# EAGLE design M908X (EAGLE 6.6.0)
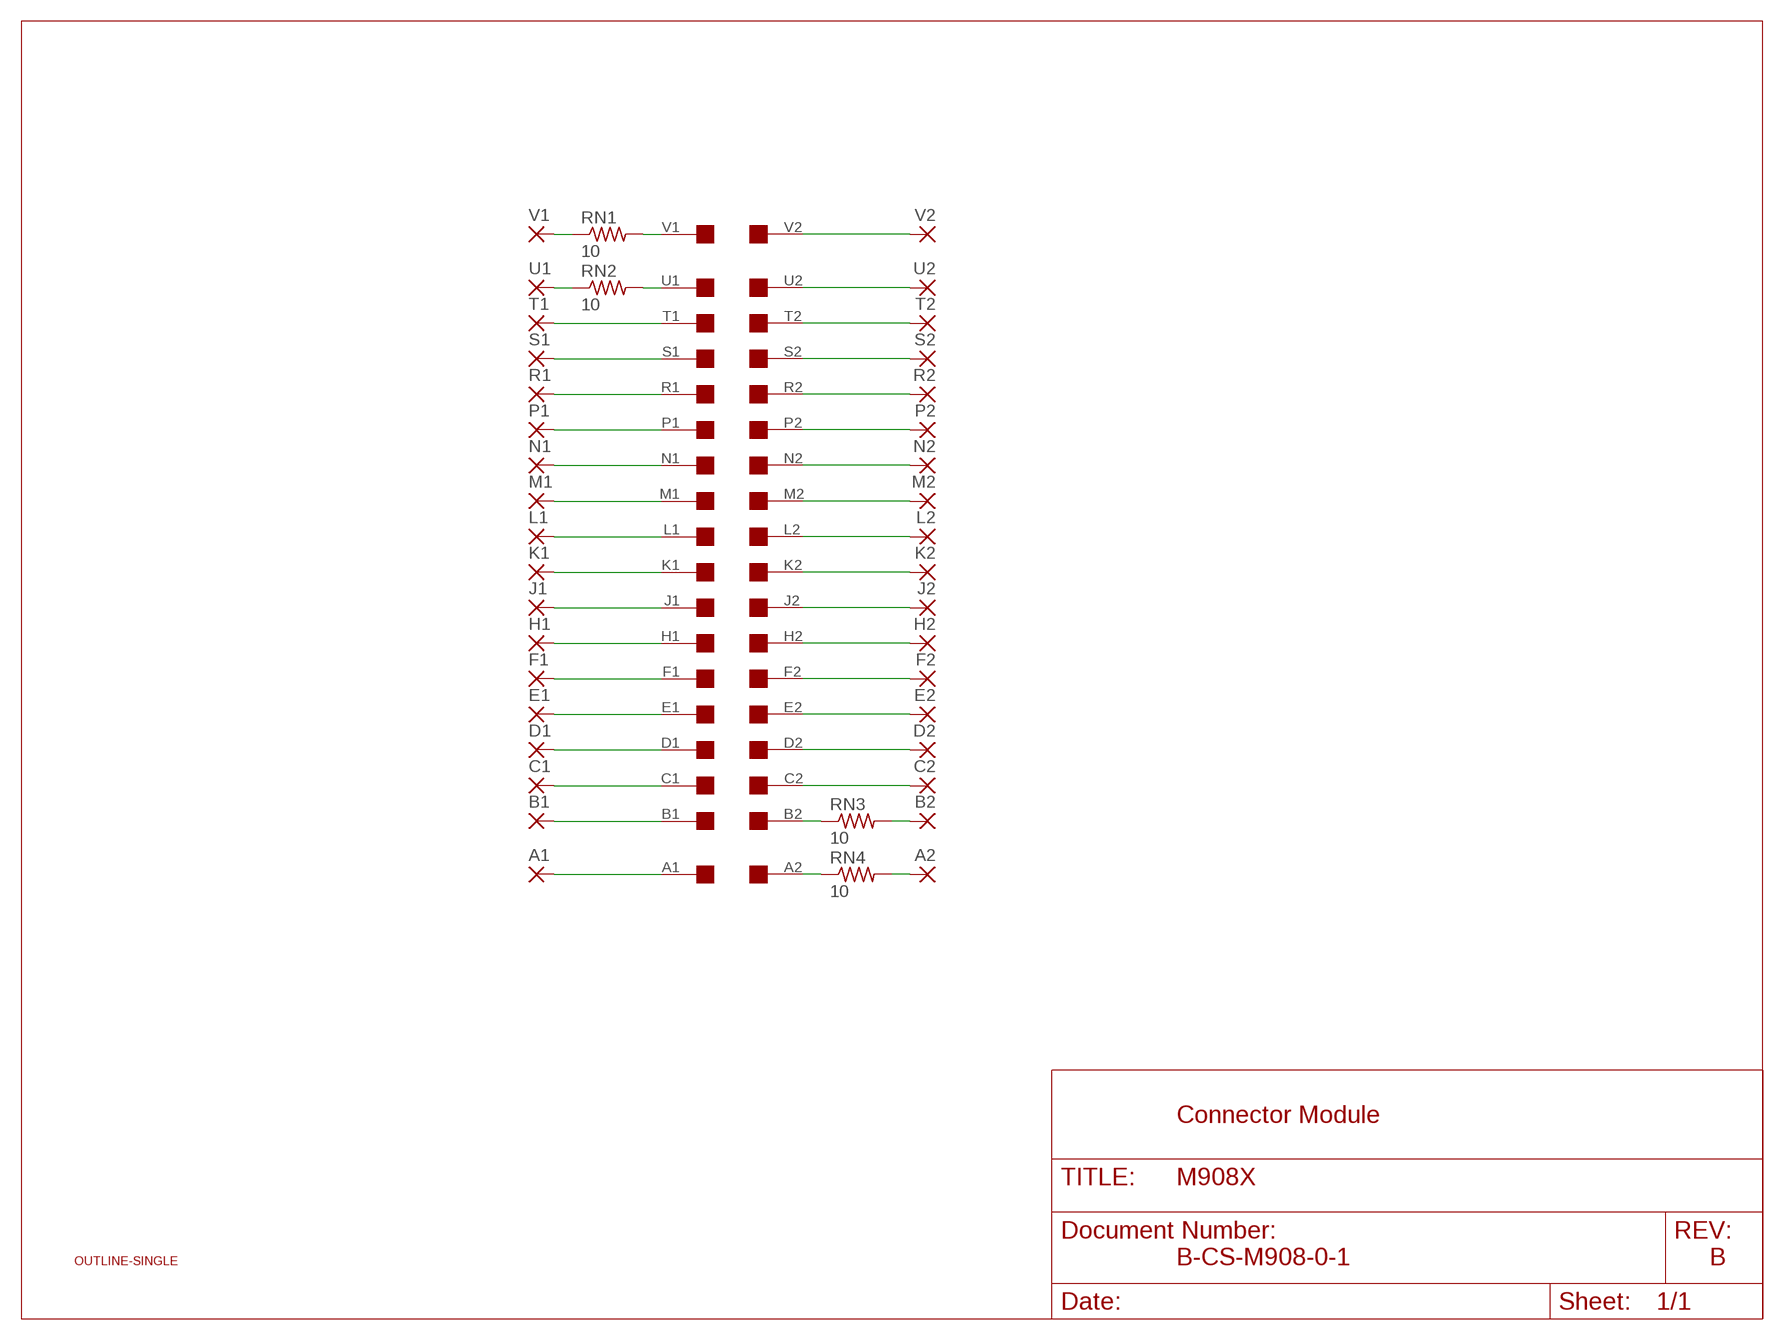
[diagram p0: schematic, sheet 1]

## Parts
A1  2,54/1,0  [2,54/1,0]
A2  2,54/1,0  [2,54/1,0]
B1  2,54/1,0  [2,54/1,0]
B2  2,54/1,0  [2,54/1,0]
C1  2,54/1,0  [2,54/1,0]
C2  2,54/1,0  [2,54/1,0]
D1  2,54/1,0  [2,54/1,0]
D2  2,54/1,0  [2,54/1,0]
E1  2,54/1,0  [2,54/1,0]
E2  2,54/1,0  [2,54/1,0]
F1  2,54/1,0  [2,54/1,0]
F2  2,54/1,0  [2,54/1,0]
H1  2,54/1,0  [2,54/1,0]
H2  2,54/1,0  [2,54/1,0]
J1  2,54/1,0  [2,54/1,0]
J2  2,54/1,0  [2,54/1,0]
K1  2,54/1,0  [2,54/1,0]
K2  2,54/1,0  [2,54/1,0]
L1  2,54/1,0  [2,54/1,0]
L2  2,54/1,0  [2,54/1,0]
M1  2,54/1,0  [2,54/1,0]
M2  2,54/1,0  [2,54/1,0]
N1  2,54/1,0  [2,54/1,0]
N2  2,54/1,0  [2,54/1,0]
P1  2,54/1,0  [2,54/1,0]
P2  2,54/1,0  [2,54/1,0]
R1  2,54/1,0  [2,54/1,0]
R2  2,54/1,0  [2,54/1,0]
RN1  10  R-US_0207/10  [0207/10]
RN2  10  R-US_0207/10  [0207/10]
RN3  10  R-US_0207/10  [0207/10]
RN4  10  R-US_0207/10  [0207/10]
S1  2,54/1,0  [2,54/1,0]
S2  2,54/1,0  [2,54/1,0]
T1  2,54/1,0  [2,54/1,0]
T2  2,54/1,0  [2,54/1,0]
U1  2,54/1,0  [2,54/1,0]
U2  2,54/1,0  [2,54/1,0]
U$1  SINGLE  [EDGE-CON2]
U$2  OUTLINE-SINGLE  [SINGLE]
V1  2,54/1,0  [2,54/1,0]
V2  2,54/1,0  [2,54/1,0]

## Nets
N$4: D1.1(P) U$1.D1
N$5: E1.1(P) U$1.E1
N$6: F1.1(P) U$1.F1
N$7: H1.1(P) U$1.H1
N$8: J1.1(P) U$1.J1
N$9: K1.1(P) U$1.K1
N$10: L1.1(P) U$1.L1
N$11: M1.1(P) U$1.M1
N$12: N1.1(P) U$1.N1
N$13: P1.1(P) U$1.P1
N$14: R1.1(P) U$1.R1
N$15: S1.1(P) U$1.S1
N$16: T1.1(P) U$1.T1
N$17: RN2.2 U$1.U1
N$18: RN1.2 U$1.V1
N$19: A2.1(P) RN4.2
N$20: B2.1(P) RN3.2
N$21: C2.1(P) U$1.C2
N$22: D2.1(P) U$1.D2
N$23: E2.1(P) U$1.E2
N$24: F2.1(P) U$1.F2
N$25: H2.1(P) U$1.H2
N$26: J2.1(P) U$1.J2
N$27: K2.1(P) U$1.K2
N$28: L2.1(P) U$1.L2
N$29: M2.1(P) U$1.M2
N$30: N2.1(P) U$1.N2
N$31: P2.1(P) U$1.P2
N$32: R2.1(P) U$1.R2
N$33: S2.1(P) U$1.S2
N$34: T2.1(P) U$1.T2
N$35: U2.1(P) U$1.U2
N$36: U$1.V2 V2.1(P)
N$37: RN1.1 V1.1(P)
N$38: RN2.1 U1.1(P)
N$39: RN3.1 U$1.B2
N$40: RN4.1 U$1.A2
N$41: A1.1(P) U$1.A1
N$42: B1.1(P) U$1.B1
N$43: C1.1(P) U$1.C1

## Notes on the sheet
- Connector Module
- B-CS-M908-0-1 | B

## Library data of the parts
A1 A2 B1 B2 C1 C2 D1 D2 E1 E2 F1 F2 H1 H2 J1 J2 K1 K2 L1 L2 M1 M2 N1 N2 P1 P2 R1 R2 S1 S2 T1 T2 U1 U2 V1 V2 = wirepad:2,54/1,0: THROUGH-HOLE PAD
RN1-RN4 = rcl:R-US_: RESISTOR, American symbol
U$1 = dec-con:SINGLE: Single-Height DEC board
U$2 = dec-con:OUTLINE-*: Board outlines for DEC boards.

## Board
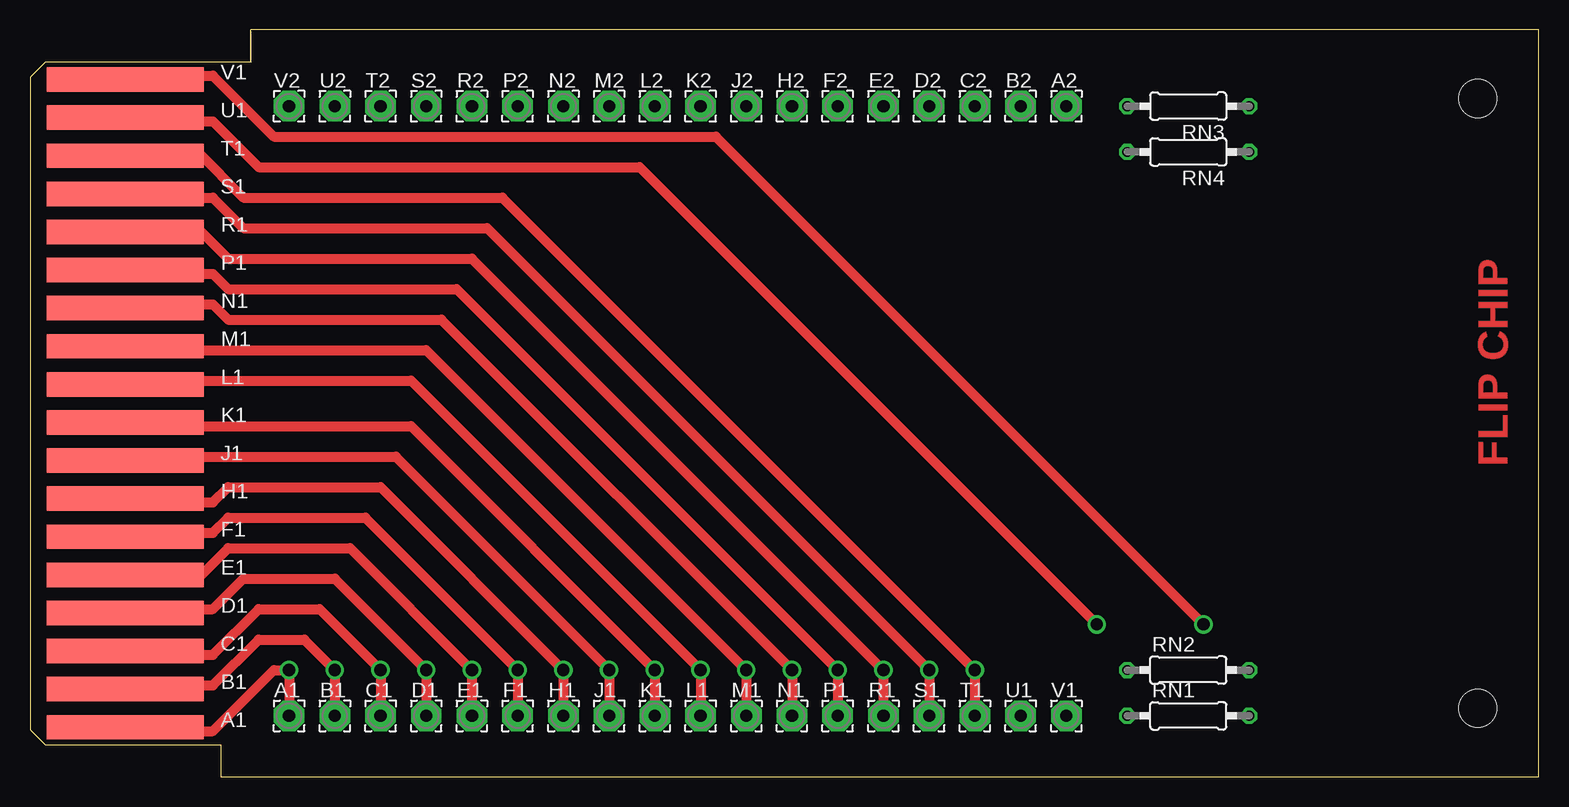
[diagram p1: board, top side]
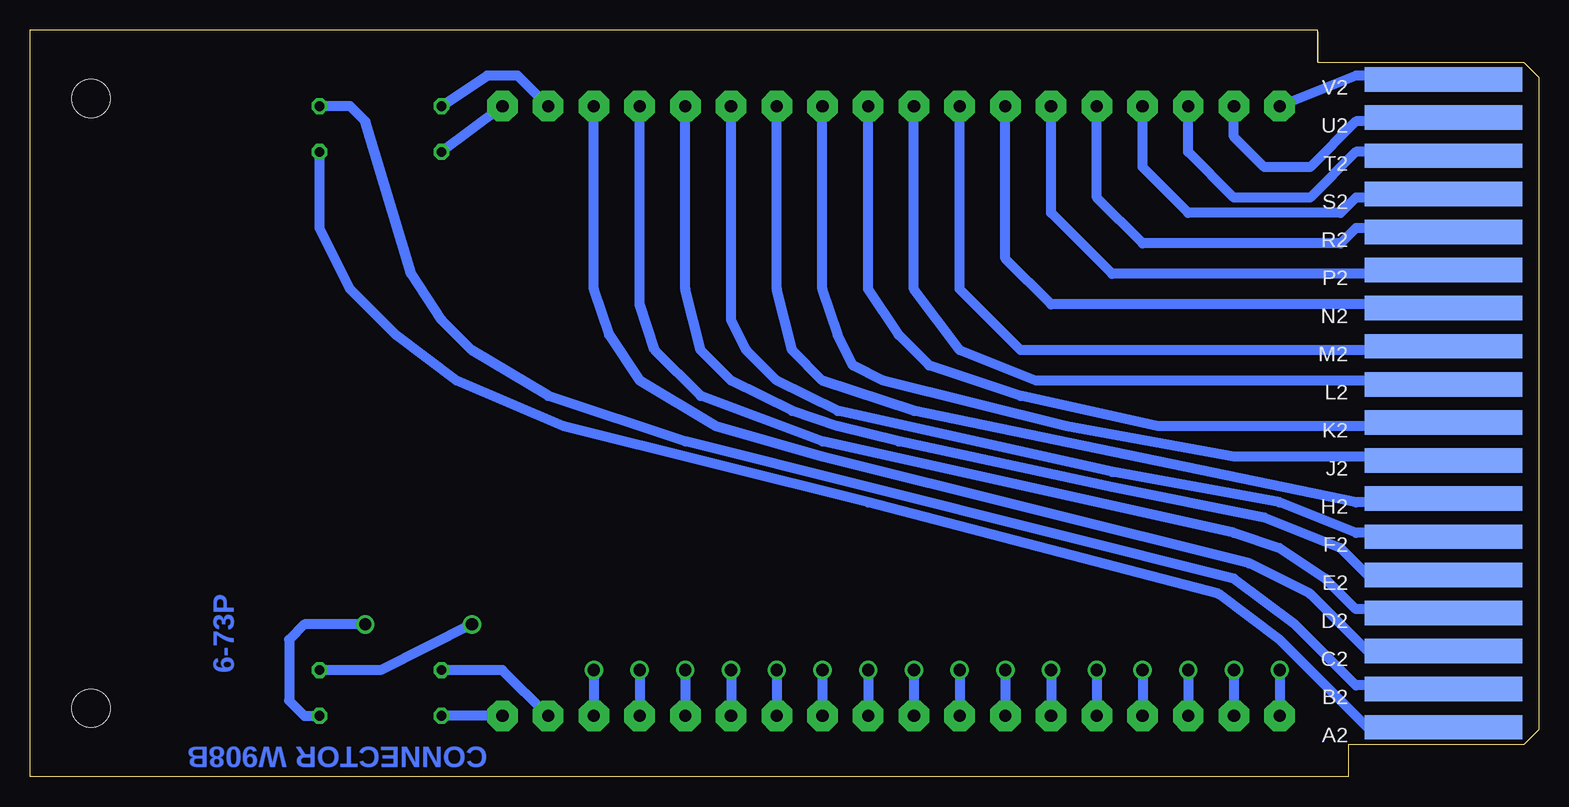
[diagram p2: board, bottom side, seen from below]

Size 125.73 x 62.23 mm. Coordinates in mm from the lower left corner, seen from the top.
Copper layers (1+16): Top 0.035mm / dielectric 1.5mm / Bottom 0.035mm
Design rules "16mils": minimum track width 16mil, minimum drill 32mil, track to track 15mil, track to pad 10mil, pad to pad 10mil, via to via 10mil, smd to smd 10mil, copper to edge 13mil, drill to drill 10mil, minimum pad ring 10mil, minimum via ring 8mil, stop-mask expansion 0mil, vias tented up to drill 0mil, thermal gap 10mil

### Footprints (pad centres in the part's own frame; a part is rotated, then mirrored left to right if it is on the bottom)
2,54/1,0 = drill 1.016 pad 2.54 octagon: 1 0,0
0207/10 = drill 0.813 octagon: 1 -5.08,0; 2 5.08,0
EDGE-CON2 = smd 13.106 x 2.032: A1 7.938,4.128; B1 7.938,7.303; C1 7.938,10.477; D1 7.938,13.652; E1 7.938,16.828; F1 7.938,20.003; H1 7.938,23.177; J1 7.938,26.352; K1 7.938,29.527; L1 7.938,32.703; M1 7.938,35.877; N1 7.938,39.053; P1 7.938,42.227; R1 7.938,45.403; S1 7.938,48.578; T1 7.938,51.752; U1 7.938,54.928; V1 7.938,58.102 | smd 13.106 x 2.032 bottom: A2 7.938,4.128; B2 7.938,7.303; C2 7.938,10.477; D2 7.938,13.652; E2 7.938,16.828; F2 7.938,20.003; H2 7.938,23.177; J2 7.938,26.352; K2 7.938,29.527; L2 7.938,32.703; M2 7.938,35.877; N2 7.938,39.053; P2 7.938,42.227; R2 7.938,45.403; S2 7.938,48.578; T2 7.938,51.752; U2 7.938,54.928; V2 7.938,58.102
SINGLE = hole 3.175: 120.65,56.515; 120.65,5.715

### Placement (x,y rotation side)
A1  21.59,5.08 0 top
A2  86.36,55.88 0 top
B1  25.4,5.08 0 top
B2  82.55,55.88 0 top
C1  29.21,5.08 0 top
C2  78.74,55.88 0 top
D1  33.02,5.08 0 top
D2  74.93,55.88 0 top
E1  36.83,5.08 0 top
E2  71.12,55.88 0 top
F1  40.64,5.08 0 top
F2  67.31,55.88 0 top
H1  44.45,5.08 0 top
H2  63.5,55.88 0 top
J1  48.26,5.08 0 top
J2  59.69,55.88 0 top
K1  52.07,5.08 0 top
K2  55.88,55.88 0 top
L1  55.88,5.08 0 top
L2  52.07,55.88 0 top
M1  59.69,5.08 0 top
M2  48.26,55.88 0 top
N1  63.5,5.08 0 top
N2  44.45,55.88 0 top
P1  67.31,5.08 0 top
P2  40.64,55.88 0 top
R1  71.12,5.08 0 top
R2  36.83,55.88 0 top
RN1  96.52,5.08 0 top
RN2  96.52,8.89 0 top
RN3  96.52,55.88 180 top
RN4  96.52,52.07 180 top
S1  74.93,5.08 0 top
S2  33.02,55.88 0 top
T1  78.74,5.08 0 top
T2  29.21,55.88 0 top
U1  82.55,5.08 0 top
U2  25.4,55.88 0 top
U$1  0,0 0 top
U$2  0,0 0 top
U$3  [FLIPCHIP]  125.73,62.23 180 top
V1  86.36,5.08 0 top
V2  21.59,55.88 0 top

### Tracks (layer width: path | path; a pad name or v marks a point on that pad's centre or on a via)
N$4  (via drill 1.02)
  Top 0.813: D1.1 v33.02,8.89 25.4,16.51 17.78,16.51 15.24,13.97 8.26,13.97 U$1.D1
  Bottom 0.813: v33.02,8.89 D1.1
N$5  (via drill 1.02)
  Top 0.813: E1.1 v36.83,8.89 26.67,19.05 16.51,19.05 13.97,16.51 8.26,16.51 U$1.E1
  Bottom 0.813: v36.83,8.89 E1.1
N$6  (via drill 1.02)
  Top 0.813: F1.1 v40.64,8.89 27.94,21.59 16.51,21.59 15.24,20.32 8.26,20.32 U$1.F1
  Bottom 0.813: v40.64,8.89 F1.1
N$7  (via drill 1.02)
  Top 0.813: H1.1 v44.45,8.89 29.21,24.13 16.51,24.13 15.24,22.86 8.26,22.86 U$1.H1
  Bottom 0.813: v44.45,8.89 H1.1
N$8  (via drill 1.02)
  Top 0.813: J1.1 v48.26,8.89 30.48,26.67 8.26,26.67 U$1.J1
  Bottom 0.813: v48.26,8.89 J1.1
N$9  (via drill 1.02)
  Top 0.813: K1.1 v52.07,8.89 31.75,29.21 8.26,29.21 U$1.K1
  Bottom 0.813: v52.07,8.89 K1.1
N$10  (via drill 1.02)
  Top 0.813: L1.1 v55.88,8.89 31.75,33.02 8.26,33.02 U$1.L1
  Bottom 0.813: v55.88,8.89 L1.1
N$11  (via drill 1.02)
  Top 0.813: M1.1 v59.69,8.89 33.02,35.56 8.26,35.56 U$1.M1
  Bottom 0.813: v59.69,8.89 M1.1
N$12  (via drill 1.02)
  Top 0.813: N1.1 v63.5,8.89 34.29,38.1 16.51,38.1 15.24,39.37 8.26,39.37 U$1.N1
  Bottom 0.813: v63.5,8.89 N1.1
N$13  (via drill 1.02)
  Top 0.813: P1.1 v67.31,8.89 35.56,40.64 16.51,40.64 15.24,41.91 8.26,41.91 U$1.P1
  Bottom 0.813: v67.31,8.89 P1.1
N$14  (via drill 1.02)
  Top 0.813: R1.1 v71.12,8.89 36.83,43.18 16.51,43.18 13.97,45.72 8.26,45.72 U$1.R1
  Bottom 0.813: v71.12,8.89 R1.1
N$15  (via drill 1.02)
  Top 0.813: S1.1 v74.93,8.89 38.1,45.72 17.78,45.72 15.24,48.26 8.26,48.26 U$1.S1
  Bottom 0.813: v74.93,8.89 S1.1
N$16  (via drill 1.02)
  Top 0.813: T1.1 v78.74,8.89 39.37,48.26 17.78,48.26 13.97,52.07 8.26,52.07 U$1.T1
  Bottom 0.813: v78.74,8.89 T1.1
N$17  (via drill 1.02)
  Top 0.813: v88.9,12.7 50.8,50.8 19.05,50.8 15.24,54.61 8.26,54.61 U$1.U1
  Bottom 0.813: RN2.2 96.52,8.89 v88.9,12.7
N$18  (via drill 1.02)
  Top 0.813: v97.79,12.7 57.15,53.34 20.32,53.34 15.24,58.42 8.26,58.42 U$1.V1
  Bottom 0.813: RN1.2 102.87,5.08 104.14,6.35 104.14,11.43 102.87,12.7 v97.79,12.7
N$19
  Bottom 0.813: RN4.2 A2.1
N$20
  Bottom 0.813: B2.1 85.09,58.42 87.63,58.42 RN3.2
N$21
  Bottom 0.813: U$1.C2 8.26,10.16 13.97,10.16 19.05,15.24 24.13,17.78 59.69,26.67 68.58,29.21 74.93,33.02 77.47,36.83 78.74,40.64 C2.1
N$22
  Bottom 0.813: U$1.D2 8.26,13.97 15.24,13.97 17.78,16.51 21.59,19.05 25.4,20.32 59.69,27.94 69.85,31.75 73.66,35.56 74.93,39.37 D2.1
N$23
  Bottom 0.813: U$1.E2 8.26,16.51 13.97,16.51 16.51,19.05 22.86,21.59 35.56,24.13 53.34,27.94 58.42,29.21 62.23,30.48 67.31,33.02 69.85,35.56 71.12,40.64 E2.1
N$24
  Bottom 0.813: U$1.F2 8.26,20.32 15.24,20.32 21.59,22.86 35.56,25.4 58.42,30.48 63.5,33.02 66.04,35.56 67.31,38.1 F2.1
N$25
  Bottom 0.813: H2.1 63.5,40.64 62.23,35.56 59.69,33.02 52.07,30.48 15.24,22.86 8.26,22.86 U$1.H2
N$26
  Bottom 0.813: J2.1 59.69,40.64 58.42,36.83 57.15,34.29 54.61,33.02 39.37,29.21 25.4,26.67 8.26,26.67 U$1.J2
N$27
  Bottom 0.813: K2.1 55.88,40.64 53.34,36.83 50.8,34.29 43.18,31.75 31.75,29.21 8.26,29.21 U$1.K2
N$28
  Bottom 0.813: L2.1 52.07,40.64 48.26,35.56 41.91,33.02 8.26,33.02 U$1.L2
N$29
  Bottom 0.813: U$1.M2 8.26,35.56 43.18,35.56 48.26,40.64 M2.1
N$30
  Bottom 0.813: U$1.N2 8.26,39.37 40.64,39.37 44.45,43.18 N2.1
N$31
  Bottom 0.813: P2.1 40.64,46.99 35.56,41.91 8.26,41.91 U$1.P2
N$32
  Bottom 0.813: R2.1 36.83,48.26 33.02,44.45 16.51,44.45 15.24,45.72 8.26,45.72 U$1.R2
N$33
  Bottom 0.813: S2.1 33.02,50.8 29.21,46.99 16.51,46.99 15.24,48.26 8.26,48.26 U$1.S2
N$34
  Bottom 0.813: U$1.T2 8.26,52.07 15.24,52.07 19.05,48.26 25.4,48.26 29.21,52.07 T2.1
N$35
  Bottom 0.813: U$1.U2 8.26,54.61 15.24,54.61 19.05,50.8 22.86,50.8 25.4,53.34 U2.1
N$36
  Bottom 0.813: U$1.V2 8.26,58.42 15.24,58.42 V2.1
N$37
  Bottom 0.813: V1.1 RN1.1
N$38
  Bottom 0.813: RN2.1 86.36,8.89 U1.1
N$39
  Bottom 0.813: U$1.B2 8.26,7.62 15.24,7.62 20.32,12.7 25.4,16.51 71.12,27.94 82.55,31.75 88.9,35.56 91.44,38.1 93.98,41.91 97.79,54.61 99.06,55.88 RN3.1
N$40
  Bottom 0.813: U$1.A2 8.26,3.81 13.97,3.81 21.59,11.43 26.67,15.24 55.88,22.86 81.28,29.21 90.17,33.02 95.25,36.83 99.06,40.64 101.6,45.72 RN4.1
N$41  (via drill 1.02)
  Top 0.813: A1.1 v21.59,8.89 20.32,8.89 15.24,3.81 8.26,3.81 U$1.A1
  Bottom 0.813: v21.59,8.89 A1.1
N$42  (via drill 1.02)
  Top 0.813: B1.1 v25.4,8.89 22.86,11.43 19.05,11.43 15.24,7.62 8.26,7.62 U$1.B1
  Bottom 0.813: v25.4,8.89 B1.1
N$43  (via drill 1.02)
  Top 0.813: C1.1 v29.21,8.89 24.13,13.97 19.05,13.97 15.24,10.16 8.26,10.16 U$1.C1
  Bottom 0.813: v29.21,8.89 C1.1

### Text on the board
Bottom: 6-73P | CONNECTOR W908B
200bmp: C:/Users/Vince/Documents/websvn/trunk/Eagle/projects/DEC/Mxxx/M908/M908Bbackfb.bmp